# Altium schematic sheet Light Sensor.SchDoc
size A4
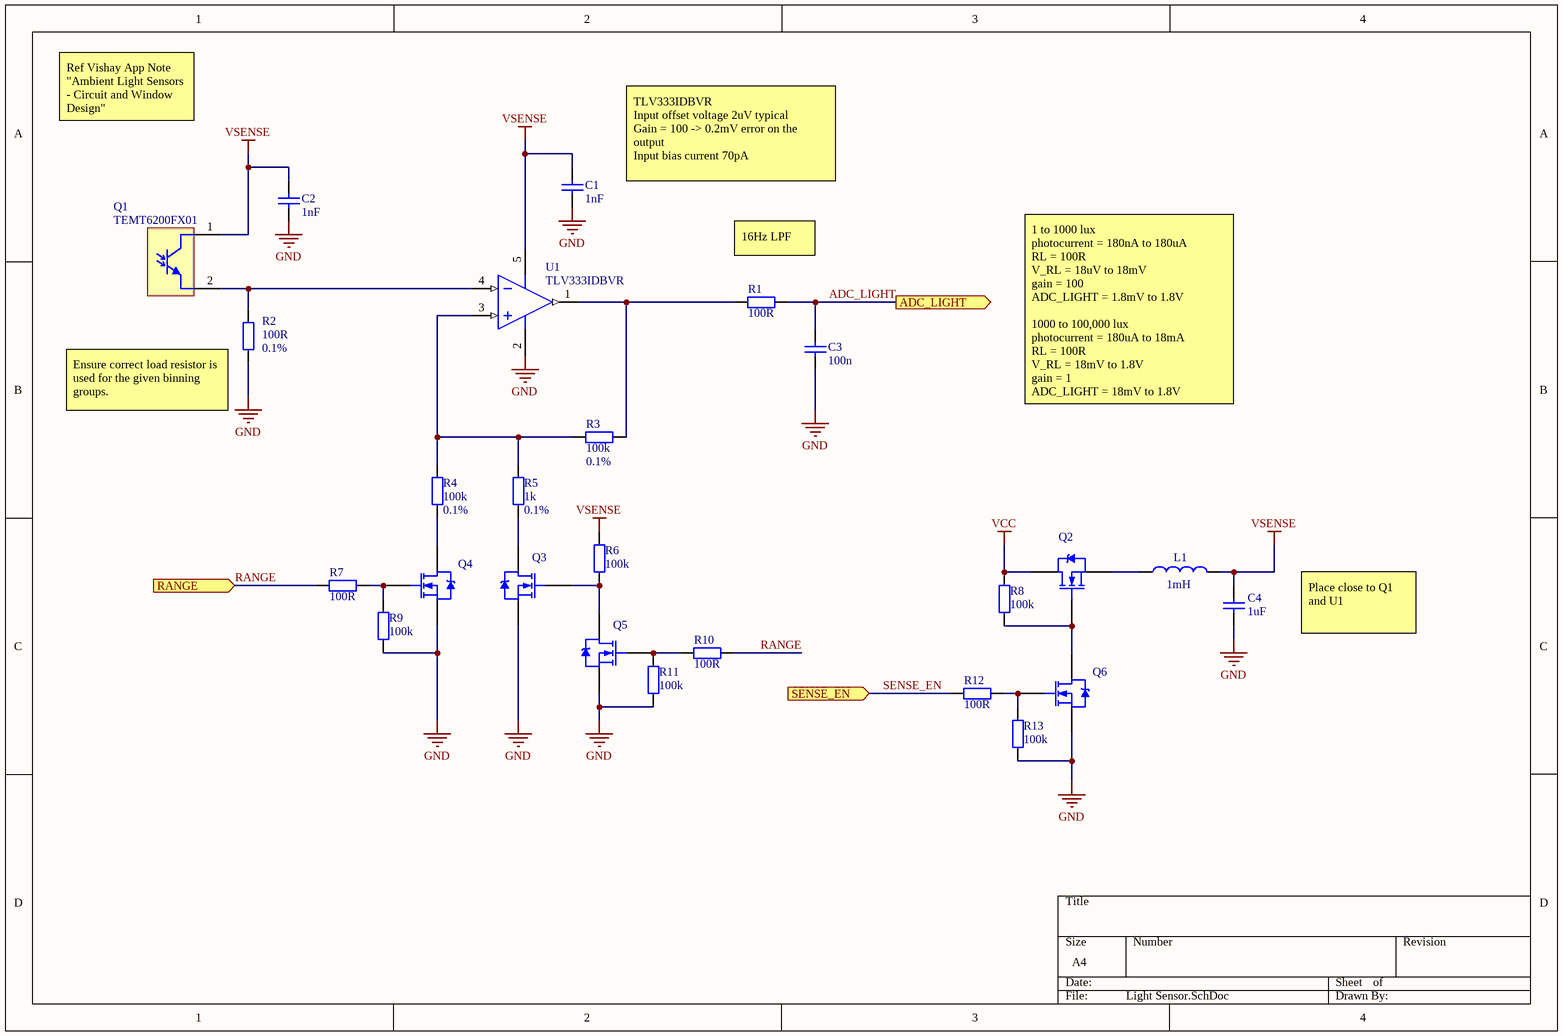
[diagram p0: Light Sensor.SchDoc]

## Parts
C1  1nF  [C0603]
C2  1nF  [C0603]
C3  100n  [C0603]
C4  Capacitance: 1uF  [C0603]
L1  Inductance: 1mH  [TAIYOYUDEN_CB2518T102K]  (hidden comment: IND)
Q1  TEMT6200FX01
Q2  2N7002ET1G  [ON_2N7002E]  (value not drawn)
Q3  2N7002ET1G  [ON_2N7002E]  (value not drawn)
Q4  2N7002ET1G  [ON_2N7002E]  (value not drawn)
Q5  2N7002ET1G  [ON_2N7002E]  (value not drawn)
Q6  2N7002ET1G  [ON_2N7002E]  (value not drawn)
R1  100R  [R0603]
R2  100R  Tolerance: 0.1%  [R0603]
R3  100k  Tolerance: 0.1%  [R0603]
R4  100k  Tolerance: 0.1%  [R0603]
R5  1k  Tolerance: 0.1%  [R0603]
R6  100k  [R0603]
R7  100R  [R0603]
R8  100k  [R0603]
R9  100k  [R0603]
R10  100R  [R0603]
R11  100k  [R0603]
R12  100R  [R0603]
R13  100k  [R0603]
U1  TLV333IDBVR  [TI_TLV333IDBVR]

## Ports
ADC_LIGHT (out), RANGE (in), SENSE_EN (in)

## Nets
GND: C1.2 C2.2 C3.1 C4.1 Q3.2(S) Q4.2(S) Q5.2(S) Q6.2(S) R2.1 R9.2 R11.2 R13.2 U1.2(V-)
VCC: Q2.3(D) R8.1
VSENSE: C1.1 C2.1 C4.2 L1.1 Q1.1(C) R6.1 U1.5(V+)
ADC_LIGHT: C3.2 R1.2 ; port ADC_LIGHT
RANGE: R7.1 R10.2 ; port RANGE
SENSE_EN: R12.1 ; port SENSE_EN
NetL1_2: L1.2 Q2.2(S)
NetQ1_2: Q1.2(E) R2.2 U1.4(IN_A-)
NetQ2_1: Q2.1(G) Q6.3(D) R8.2
NetQ3_1: Q3.1(G) Q5.3(D) R6.2
NetQ3_3: Q3.3(D) R5.2
NetQ4_1: Q4.1(G) R7.2 R9.1
NetQ4_3: Q4.3(D) R4.1
NetQ5_1: Q5.1(G) R10.1 R11.1
NetQ6_1: Q6.1(G) R12.2 R13.1
NetR1_1: R1.1 R3.2 U1.1(OUT_A)
NetR3_1: R3.1 R4.2 R5.1 U1.3(IN_A+)

## Notes on the sheet
- Ref Vishay App Note "Ambient Light Sensors - Circuit and Window Design"
- TLV333IDBVR
  Input offset voltage 2uV typical
  Gain = 100 -> 0.2mV error on the output
  Input bias current 70pA
- (near R1) 16Hz LPF
- (near R2) Ensure correct load resistor is used for the given binning groups.
- 1 to 1000 lux
  photocurrent = 180nA to 180uA
  RL = 100R
  V_RL = 18uV to 18mV
  gain = 100
  ADC_LIGHT = 1.8mV to 1.8V
  1000 to 100,000 lux
  photocurrent = 180uA to 18mA
  RL = 100R
  V_RL = 18mV to 1.8V
  gain = 1
  ADC_LIGHT = 18mV to 1.8V
- Place close to Q1 and U1

## Library data of the parts
C1 C2 = CAP: Manufacturer: Yageo; Manufacturer Part Number: CC0603KRX7R9BB102; Voltage Rating: 50V
C3 = CAP: Manufacturer: Yageo; Manufacturer Part Number: CC0603ZRY5V9BB104
C4 = CAP: Manufacturer: Yageo; Manufacturer Part Number: CC0603KRX7R9BB105; Voltage Rating: 50V
L1 = IND: Manufacturer: Taiyo Yuden; Manufacturer Part Number: CB2518T102K
Q1 = VISHAY_TEMT6200FX01: Manufacturer: Vishay; Manufacturer Part Number: TEMT6200FX01
Q2-Q6 = N-channel MOSFET: Manufacturer: ON Semiconductor; Manufacturer Part Number: 2N7002ET1G
R1 R7 R10 R12 = RES: Manufacturer: Yageo; Manufacturer Part Number: RC0603FR-07100RL; Tolerance: 1%; Footprint: *
R2 = RES: Manufacturer: Yageo; Manufacturer Part Number: RT0603BRD07100RL; Footprint: *
R3 R4 = RES: Manufacturer: Yageo; Manufacturer Part Number: RT0603BRD07100KL; Footprint: *
R5 = RES: Manufacturer: Yageo; Manufacturer Part Number: RT0603BRD071KL; Footprint: *
R6 R8 R9 R11 R13 = RES: Manufacturer: Yageo; Manufacturer Part Number: RC0603FR-07100KL; Tolerance: 1%; Footprint: *
U1 = OPAMP: Manufacturer: Texas Instruments; Manufacturer Part Number: TLV333IDBVR